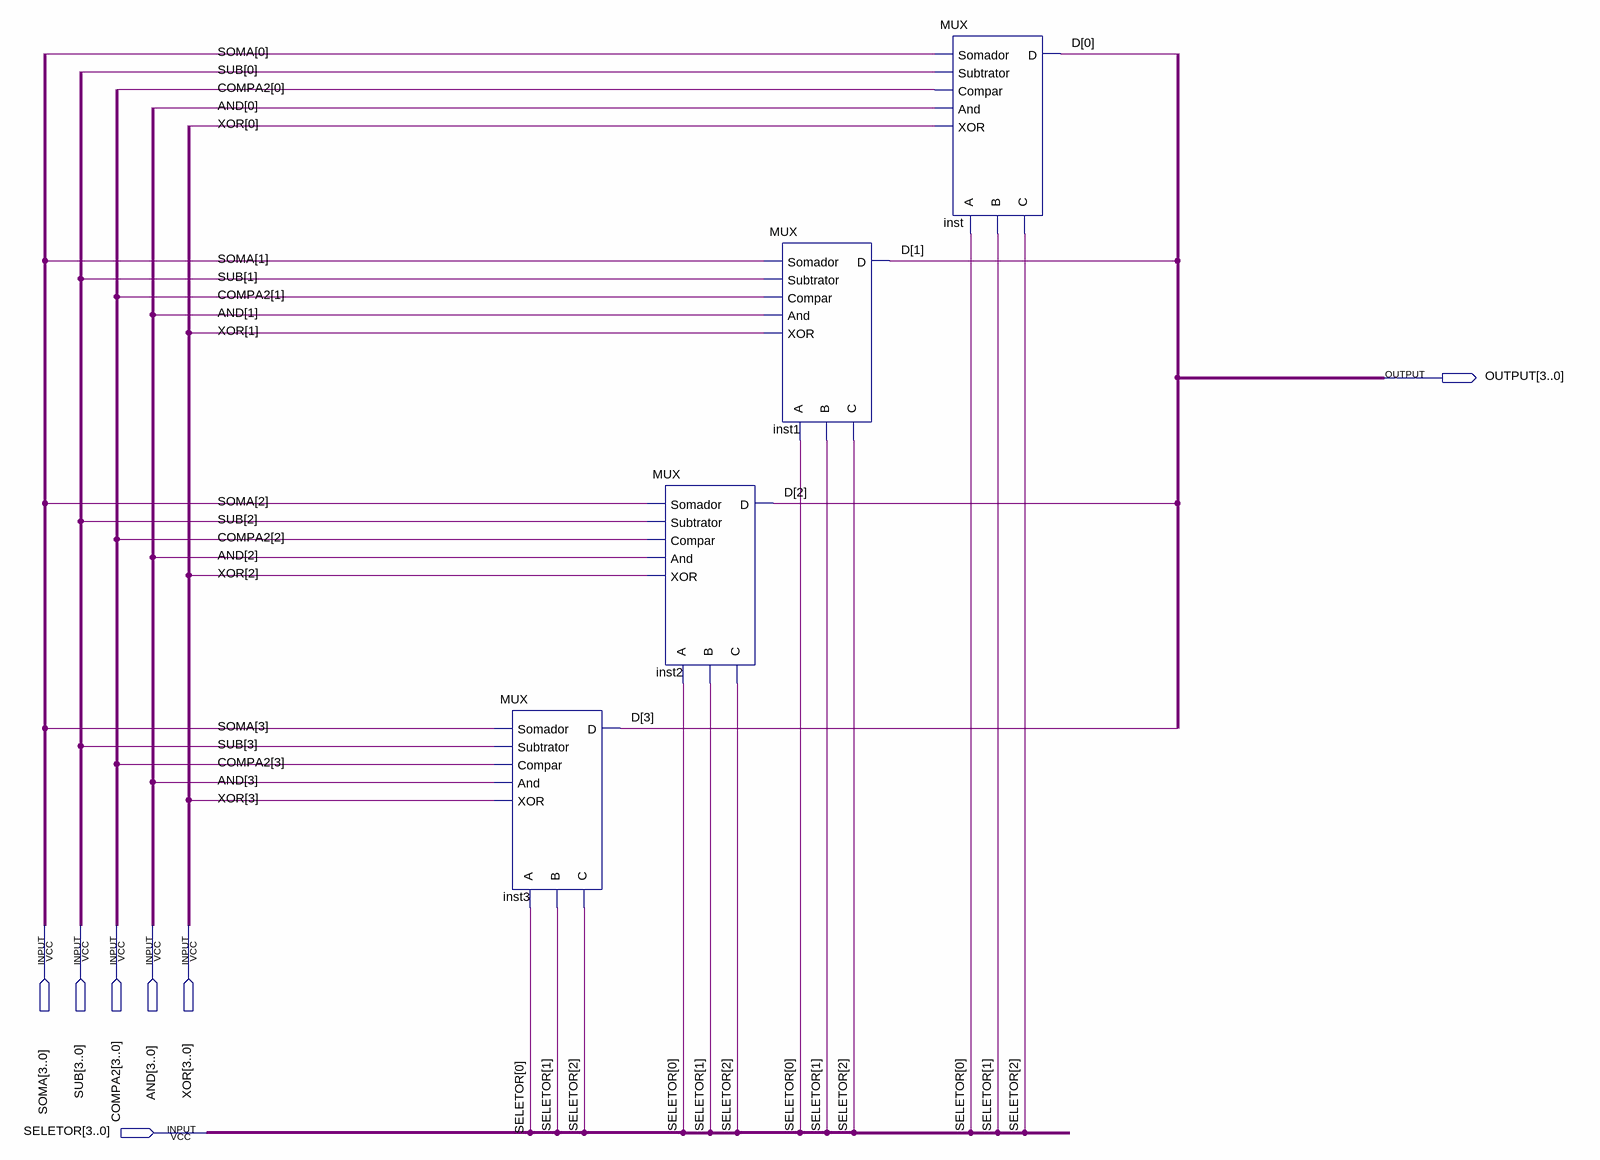
[diagram p0: schematic sheet]
// Quartus schematic MUX2.bdf as structural Verilog: 4 symbols, 7 pins
module MUX2 (
  input  [3:0] SOMA,
  input  [3:0] SUB,
  input  [3:0] COMPA2,
  input  [3:0] AND,
  input  [3:0] XOR,
  input  [3:0] SELETOR,
  output [3:0] OUTPUT
);

  wire [3:0] D;

  MUX inst3 (
    .Somador(SOMA[3]), .Subtrator(SUB[3]), .Compar(COMPA2[3]), .And(AND[3]), .XOR(XOR[3]), .A(SELETOR[0]),
    .B(SELETOR[1]), .C(SELETOR[2]), .D(D[3]));
  MUX inst2 (
    .Somador(SOMA[2]), .Subtrator(SUB[2]), .Compar(COMPA2[2]), .And(AND[2]), .XOR(XOR[2]), .A(SELETOR[0]),
    .B(SELETOR[1]), .C(SELETOR[2]), .D(D[2]));
  MUX inst1 (
    .Somador(SOMA[1]), .Subtrator(SUB[1]), .Compar(COMPA2[1]), .And(AND[1]), .XOR(XOR[1]), .A(SELETOR[0]),
    .B(SELETOR[1]), .C(SELETOR[2]), .D(D[1]));
  MUX inst (
    .Somador(SOMA[0]), .Subtrator(SUB[0]), .Compar(COMPA2[0]), .And(AND[0]), .XOR(XOR[0]), .A(SELETOR[0]),
    .B(SELETOR[1]), .C(SELETOR[2]), .D(D[0]));
endmodule
